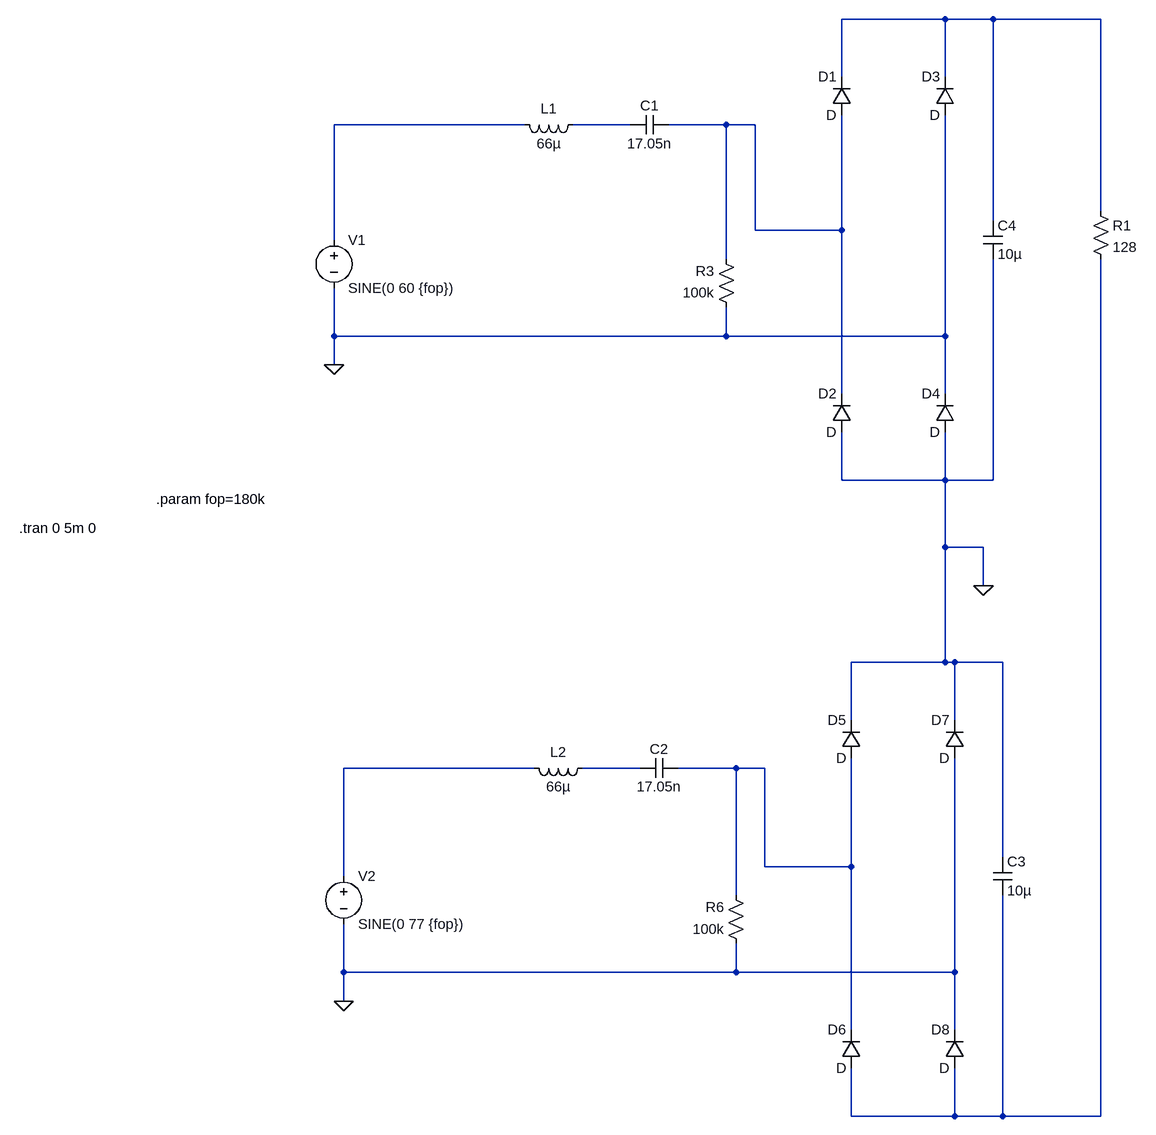
[diagram p0: schematic Series-compensation-series.asc]
Series-compensation-series.asc, the LTspice schematic file:
Version 4
SHEET 1 2752 1988
WIRE 1936 -240 1712 -240
WIRE 2016 -240 1936 -240
WIRE 2624 -240 2016 -240
WIRE 1712 -144 1712 -240
WIRE 1936 -144 1936 -240
WIRE 1184 -64 736 -64
WIRE 1360 -64 1264 -64
WIRE 1520 -64 1424 -64
WIRE 1568 -64 1520 -64
WIRE 2624 80 2624 -240
WIRE 2016 96 2016 -240
WIRE 1568 112 1568 -64
WIRE 1712 112 1712 -80
WIRE 1712 112 1568 112
WIRE 736 128 736 -64
WIRE 1520 160 1520 -64
WIRE 736 288 736 208
WIRE 1520 288 1520 240
WIRE 1520 288 736 288
WIRE 1936 288 1936 -80
WIRE 1936 288 1520 288
WIRE 736 336 736 288
WIRE 1712 384 1712 112
WIRE 1936 384 1936 288
WIRE 1712 528 1712 448
WIRE 1936 528 1936 448
WIRE 1936 528 1712 528
WIRE 2016 528 2016 160
WIRE 2016 528 1936 528
WIRE 1936 640 1936 528
WIRE 2000 640 1936 640
WIRE 2000 704 2000 640
WIRE 1936 832 1936 640
WIRE 1936 832 1728 832
WIRE 1952 832 1936 832
WIRE 2032 832 1952 832
WIRE 1728 928 1728 832
WIRE 1952 928 1952 832
WIRE 1200 1008 752 1008
WIRE 1376 1008 1280 1008
WIRE 1536 1008 1440 1008
WIRE 1584 1008 1536 1008
WIRE 2032 1168 2032 832
WIRE 1584 1184 1584 1008
WIRE 1728 1184 1728 992
WIRE 1728 1184 1584 1184
WIRE 752 1200 752 1008
WIRE 1536 1232 1536 1008
WIRE 752 1360 752 1280
WIRE 1536 1360 1536 1312
WIRE 1536 1360 752 1360
WIRE 1952 1360 1952 992
WIRE 1952 1360 1536 1360
WIRE 752 1408 752 1360
WIRE 1728 1456 1728 1184
WIRE 1952 1456 1952 1360
WIRE 1728 1600 1728 1520
WIRE 1952 1600 1952 1520
WIRE 1952 1600 1728 1600
WIRE 2032 1600 2032 1232
WIRE 2032 1600 1952 1600
WIRE 2624 1600 2624 160
WIRE 2624 1600 2032 1600
FLAG 736 336 0
FLAG 752 1408 0
FLAG 2000 704 0
SYMBOL voltage 736 112 R0
WINDOW 123 0 0 Left 0
WINDOW 39 0 0 Left 0
SYMATTR InstName V1
SYMATTR Value SINE(0 60 {fop})
SYMBOL ind 1280 -80 R90
WINDOW 0 5 56 VBottom 2
WINDOW 3 32 56 VTop 2
SYMATTR InstName L1
SYMATTR Value 66µ
SYMBOL cap 1424 -80 R90
WINDOW 0 0 32 VBottom 2
WINDOW 3 32 32 VTop 2
SYMATTR InstName C1
SYMATTR Value 17.05n
SYMBOL diode 1728 -80 R180
WINDOW 0 24 64 Left 2
WINDOW 3 24 0 Left 2
SYMATTR InstName D1
SYMBOL diode 1728 448 R180
WINDOW 0 24 64 Left 2
WINDOW 3 24 0 Left 2
SYMATTR InstName D2
SYMBOL diode 1952 -80 R180
WINDOW 0 24 64 Left 2
WINDOW 3 24 0 Left 2
SYMATTR InstName D3
SYMBOL diode 1952 448 R180
WINDOW 0 24 64 Left 2
WINDOW 3 24 0 Left 2
SYMATTR InstName D4
SYMBOL res 2608 64 R0
SYMATTR InstName R1
SYMATTR Value 128
SYMBOL cap 2000 96 R0
SYMATTR InstName C4
SYMATTR Value 10µ
SYMBOL res 1536 256 R180
WINDOW 0 36 76 Left 2
WINDOW 3 36 40 Left 2
SYMATTR InstName R3
SYMATTR Value 100k
SYMBOL voltage 752 1184 R0
WINDOW 123 0 0 Left 0
WINDOW 39 0 0 Left 0
SYMATTR InstName V2
SYMATTR Value SINE(0 77 {fop})
SYMBOL ind 1296 992 R90
WINDOW 0 5 56 VBottom 2
WINDOW 3 32 56 VTop 2
SYMATTR InstName L2
SYMATTR Value 66µ
SYMBOL cap 1440 992 R90
WINDOW 0 0 32 VBottom 2
WINDOW 3 32 32 VTop 2
SYMATTR InstName C2
SYMATTR Value 17.05n
SYMBOL diode 1744 992 R180
WINDOW 0 24 64 Left 2
WINDOW 3 24 0 Left 2
SYMATTR InstName D5
SYMBOL diode 1744 1520 R180
WINDOW 0 24 64 Left 2
WINDOW 3 24 0 Left 2
SYMATTR InstName D6
SYMBOL diode 1968 992 R180
WINDOW 0 24 64 Left 2
WINDOW 3 24 0 Left 2
SYMATTR InstName D7
SYMBOL diode 1968 1520 R180
WINDOW 0 24 64 Left 2
WINDOW 3 24 0 Left 2
SYMATTR InstName D8
SYMBOL cap 2016 1168 R0
SYMATTR InstName C3
SYMATTR Value 10µ
SYMBOL res 1552 1328 R180
WINDOW 0 36 76 Left 2
WINDOW 3 36 40 Left 2
SYMATTR InstName R6
SYMATTR Value 100k
TEXT -752 608 Left 2 !.tran 0 5m 0
TEXT 440 560 Left 2 !.param fop=180k

The netlist it stands for:
* Series-compensation-series.asc
V1 N002 0 SINE(0 60 {fop})
L1 N003 N002 66µ
C1 N004 N003 17.05n
D1 N004 N001 D
D2 0 N004 D
D3 0 N001 D
D4 0 0 D
R1 N001 N008 128
C4 N001 0 10µ
R3 0 N004 100k
V2 N005 0 SINE(0 77 {fop})
L2 N006 N005 66µ
C2 N007 N006 17.05n
D5 N007 0 D
D6 N008 N007 D
D7 0 0 D
D8 N008 0 D
C3 0 N008 10µ
R6 0 N007 100k
.model D D
.lib standard.dio
.tran 0 5m 0
.param fop=180k
.backanno
.end